# EAGLE design Low Noise PS Filter Only (EAGLE 6.5.0)
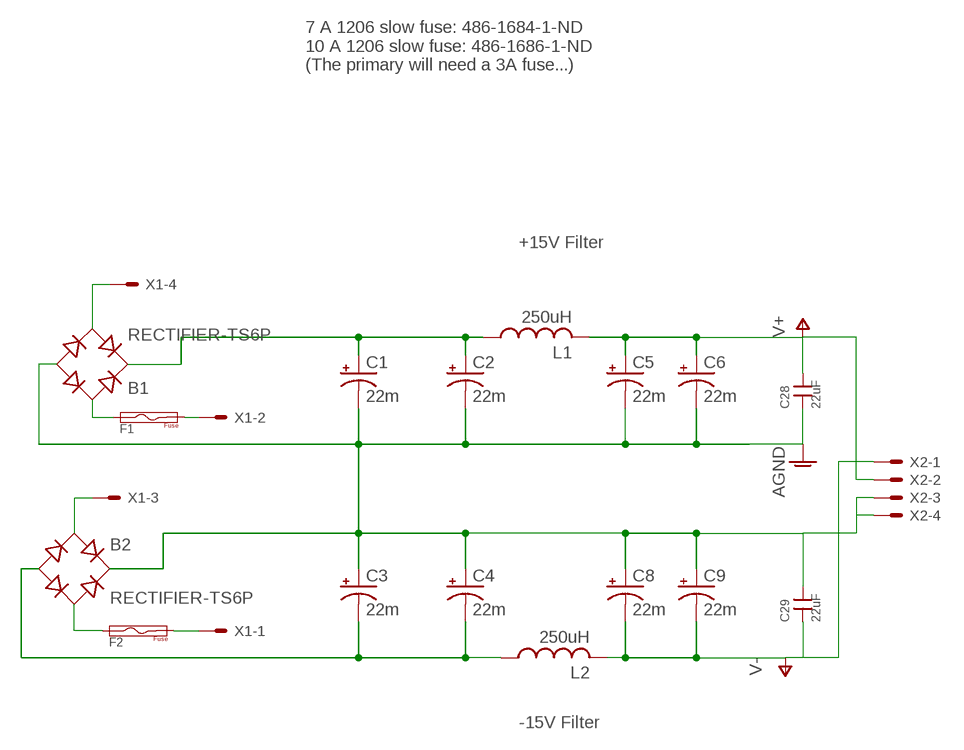
[diagram p0: schematic, sheet 1]

## Parts
B1  RECTIFIER-TS6P  [TS6P]
B2  RECTIFIER-TS6P  [TS6P]
C1  22m  CPOL-USEB35D  [EB35D]
C2  22m  CPOL-USEB35D  [EB35D]
C3  22m  CPOL-USEB35D  [EB35D]
C4  22m  CPOL-USEB35D  [EB35D]
C5  22m  CPOL-USEB35D  [EB35D]
C6  22m  CPOL-USEB35D  [EB35D]
C8  22m  CPOL-USEB35D  [EB35D]
C9  22m  CPOL-USEB35D  [EB35D]
C28  22uF  CAP1206  [1206]
C29  22uF  CAP1206  [1206]
F1  FUSE1206  [FUSE1206]
F2  FUSE1206  [FUSE1206]
L1  250uH  INDUCTOR5721-RC  [5721-RC]
L2  250uH  INDUCTOR5721-RC  [5721-RC]
X1  5566-4  [5566-4]
X2  5566-4  [5566-4]

## Nets
AGND: B1.- B2.+ C1.- C2.- C3.+ C4.+ C5.- C6.- C8.+ C9.+ C28.1 C29.2 X2.3 X2.4
N$1: B1.AC1 F1.1
N$2: B1.AC2 X1.4
N$3: B1.+ C1.+ C2.+ L1.P$1
N$4: B2.AC1 X1.3
N$5: F1.2 X1.2
N$6: F2.2 X1.1
N$8: B2.- C3.- C4.- L2.P$1
N$24: B2.AC2 F2.1
V+: C5.+ C6.+ C28.2 L1.P$2 X2.2
V-: C8.- C9.- C29.1 L2.P$2 X2.1

## Notes on the sheet
- 7 A 1206 slow fuse: 486-1684-1-ND
  10 A 1206 slow fuse: 486-1686-1-ND
  (The primary will need a 3A fuse...)
- +15V Filter
- -15V Filter

## Library data of the parts
B1 B2 = jqi-power-supply:RECTIFIER-: Rectifier; DIGIKEY: DFB2005-ND
C1-C6 C8 C9 = jqi-power-supply:CPOL-US; DIGIKEY: 565-2880-ND
C28 C29 = rlc-jqi:CAP: SMT Capacitor; DIGIKEY: 445-8045-1-ND
F1 F2 = jqi-power-supply:FUSE; DIGIKEY: 486-1686-1-ND
L1 L2 = jqi-power-supply:INDUCTOR; DIGIKEY: M8725-ND
X1 X2 = jqi-power-supply:5566-4: Mini FIT connector 4 pol Source: http://www.molex.com; OC_FARNELL: unknown; OC_NEWARK: unknown

## Board
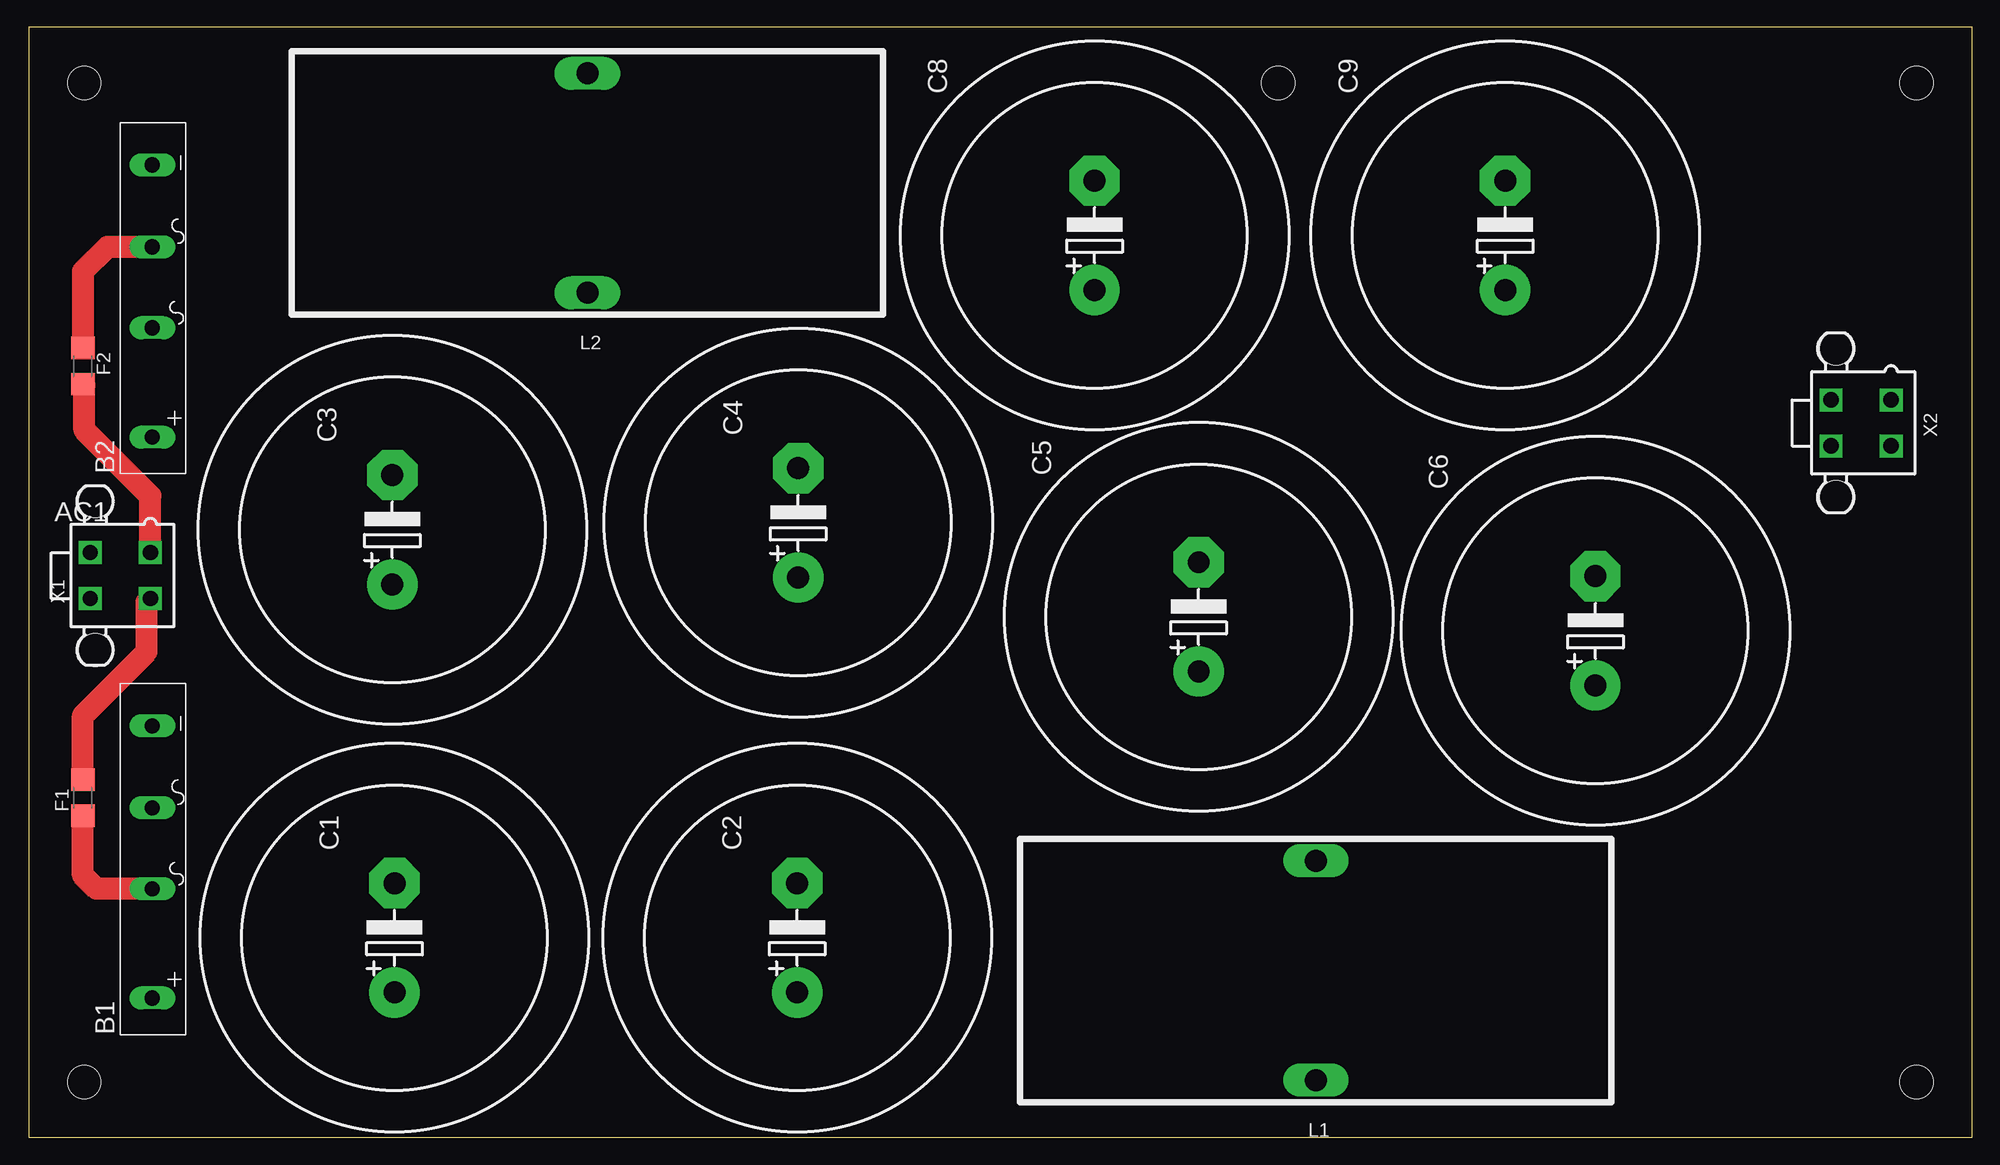
[diagram p1: board, top side]
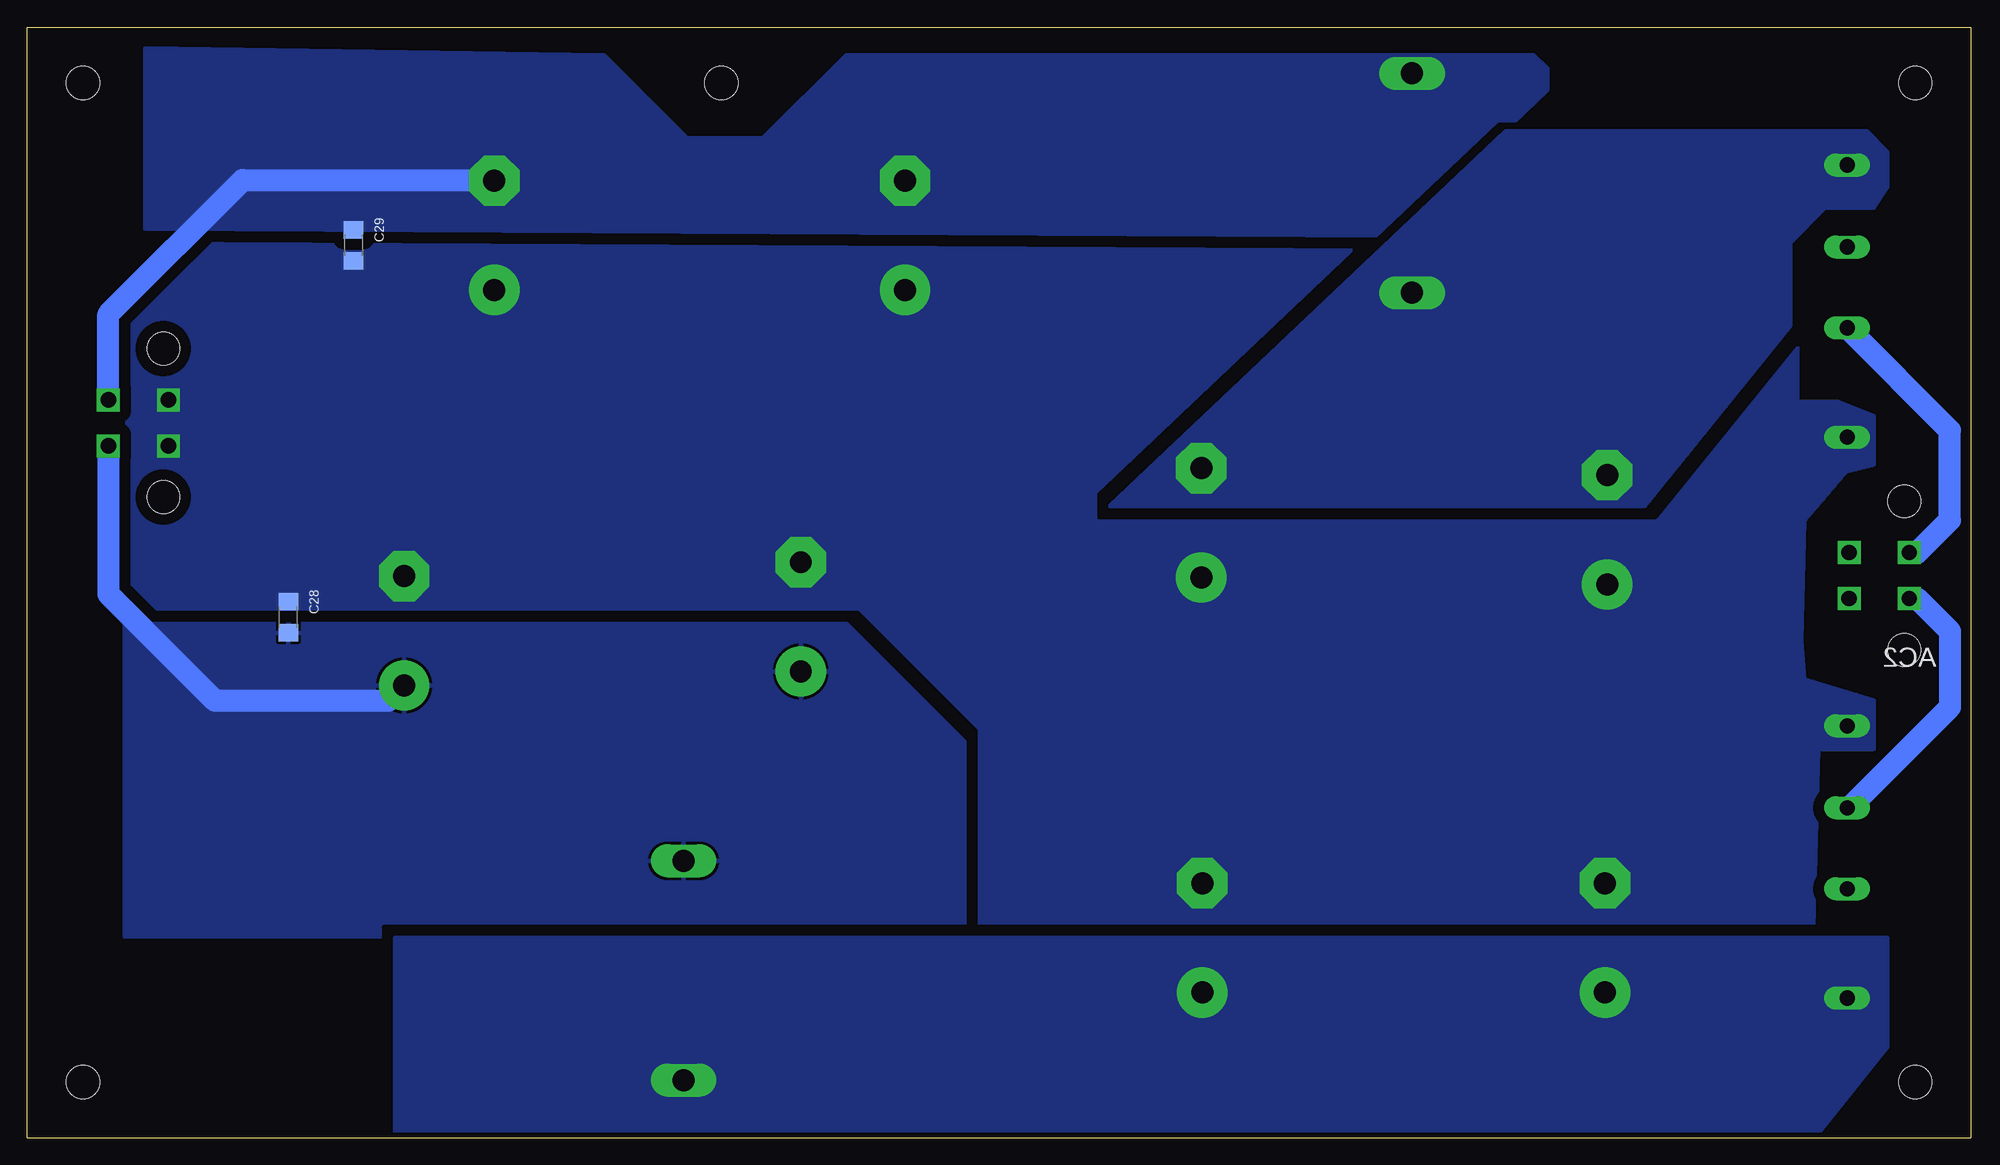
[diagram p2: board, bottom side, seen from below]

Size 177.8 x 101.6 mm. Coordinates in mm from the lower left corner, seen from the top.
Outline: 177.8,0 177.8,101.6 0,101.6 0,0 177.8,0
Copper layers (1+2*15+16): Top 0.0178mm / dielectric 12mil / Route2 0.0356mm / dielectric 28mil / Route15 0.0356mm / dielectric 12mil / Bottom 0.0178mm
Design rules "SSC-EAGLE-4Lyr_v1.0.0.3": minimum track width 6mil, minimum drill 8mil, track to track 6mil, track to pad 6mil, pad to pad 6mil, via to via 6mil, smd to smd 6mil, copper to edge 20mil, drill to drill 16mil, minimum pad ring 8mil, minimum via ring 8mil, stop-mask expansion 3mil, vias tented up to drill 0mil, thermal gap 10mil
Holes 3.05 mm at 172.72,5.08 172.72,96.52 5.08,96.52 5.08,5.08 114.3,96.52

### Footprints (pad centres in the part's own frame; a part is rotated, then mirrored left to right if it is on the bottom)
TS6P = drill 1.397 long: + -13.7,0; - 11.2,0; AC1 -3.7,0; AC2 3.7,0
EB35D = drill 2.007 pad 4.597: + -5,0 | drill 2.007 pad 4.597 octagon: - 5,0
1206 = smd 1.6 x 1.803: 1 -1.422,0; 2 1.422,0
FUSE1206 = smd 2.032 x 2.159: 1 -1.651,0; 2 1.651,0
5721-RC = drill 2 long: P$1 0,10.033; P$2 0,-10.033
5566-4 = drill 1.4 square: 1 2.1,-2.75; 2 -2.1,-2.75; 3 2.1,2.75; 4 -2.1,2.75 | hole 3: 6.8,2.29; -6.8,2.29

### Placement (x,y rotation side)
B1  11.3,26.48 90 top
B2  11.3,77.81 90 top
C1  33.47,18.29 90 top
C2  70.31,18.29 90 top
C3  33.27,55.63 90 top
C4  70.4,56.26 90 top
C5  107.03,47.65 90 top
C6  143.33,46.38 90 top
C8  97.51,82.57 90 top
C9  135.07,82.57 90 top
C28  153.92,47.62 270 bottom
C29  147.96,81.66 270 bottom
F1  4.95,31.11 90 top
F2  4.95,70.61 270 top
L1  117.75,15.29 180 top
L2  51.12,87.36 180 top
X1  8.38,51.44 90 top
X2  167.64,65.41 90 top

### Tracks (layer width: path | path; a pad name or v marks a point on that pad's centre or on a via)
AGND
  pour Bottom (isolate 1.016, rank 3, no thermals): 15.24,41.91 15.49,45.47 15.24,56.52 11.43,60.96 8.89,61.59 8.89,66.04 12.06,67.31 15.88,67.31 15.88,109.86 186.69,110.49 187.32,52.07 188.21,-12.06 15.24,-10.16 13.97,35.56 8.89,35.56 8.89,40.01
N$1
  Top 2.032: B1.AC1 6.18,22.77 4.95,24 F1.1
N$2
  Bottom 2.032: B1.AC2 11.1,30.18 1.91,39.37 1.91,46.35 4.88,49.34 X1.4
N$3
  pour Bottom (no thermals): 7.62,8.26 7.62,18.29 144.15,18.29 144.15,-4.45 17.78,-4.45
N$4
  Bottom 2.032: B2.AC1 1.91,64.71 1.91,56.52 4.88,53.53 X1.3
N$5
  Top 2.032: F1.2 4.95,38.61 10.79,44.45 10.79,49 X1.2
N$6
  Top 2.032: X1.1 11.13,58.72 5.08,64.77 5.08,68.83 F2.2
N$8
  pour Bottom (isolate 1.016, no thermals): 7.62,90.17 9.53,92.08 42.55,92.08 78.74,57.78 29.84,57.78 16.51,74.3 16.51,81.92 13.34,85.09 8.89,85.09 7.62,87
N$24
  Top 2.032: B2.AC2 7.21,81.5 4.95,79.25 F2.1
V+
  Bottom 2.032: X2.2 170.39,49.74 160.66,40.01 144.78,40.01 142.88,41.91 142.88,41.84 C6.+
  pour Bottom (isolate 1.016, rank 2): 92.08,18.41 92.08,36.2 102.87,46.99 168.91,46.99 168.91,18.41
V-
  Bottom 2.032: X2.1 170.39,75.36 158.12,87.63 135.13,87.63 C9.-
  pour Bottom (isolate 0.635, rank 2, no thermals): 40.01,99.06 102.87,99.06 110.49,91.44 117.47,91.44 125.09,99.06 167,99.69 167,83.19 52.7,82.55 38.73,95.89 38.73,97.79

### Text on the board
tNames: AC1
bNames: AC2